# Altium schematic sheet shutdown_circuit.SchDoc: Shutdown Circuit
size A4; Engineer: T.S, R.C, S.R, C.B; Organization: Badgerloop Electrical; Address1: 133 Engineering Research Building; Address2: 1500 Engineering Drive; Address3: Madison, Wi 53706
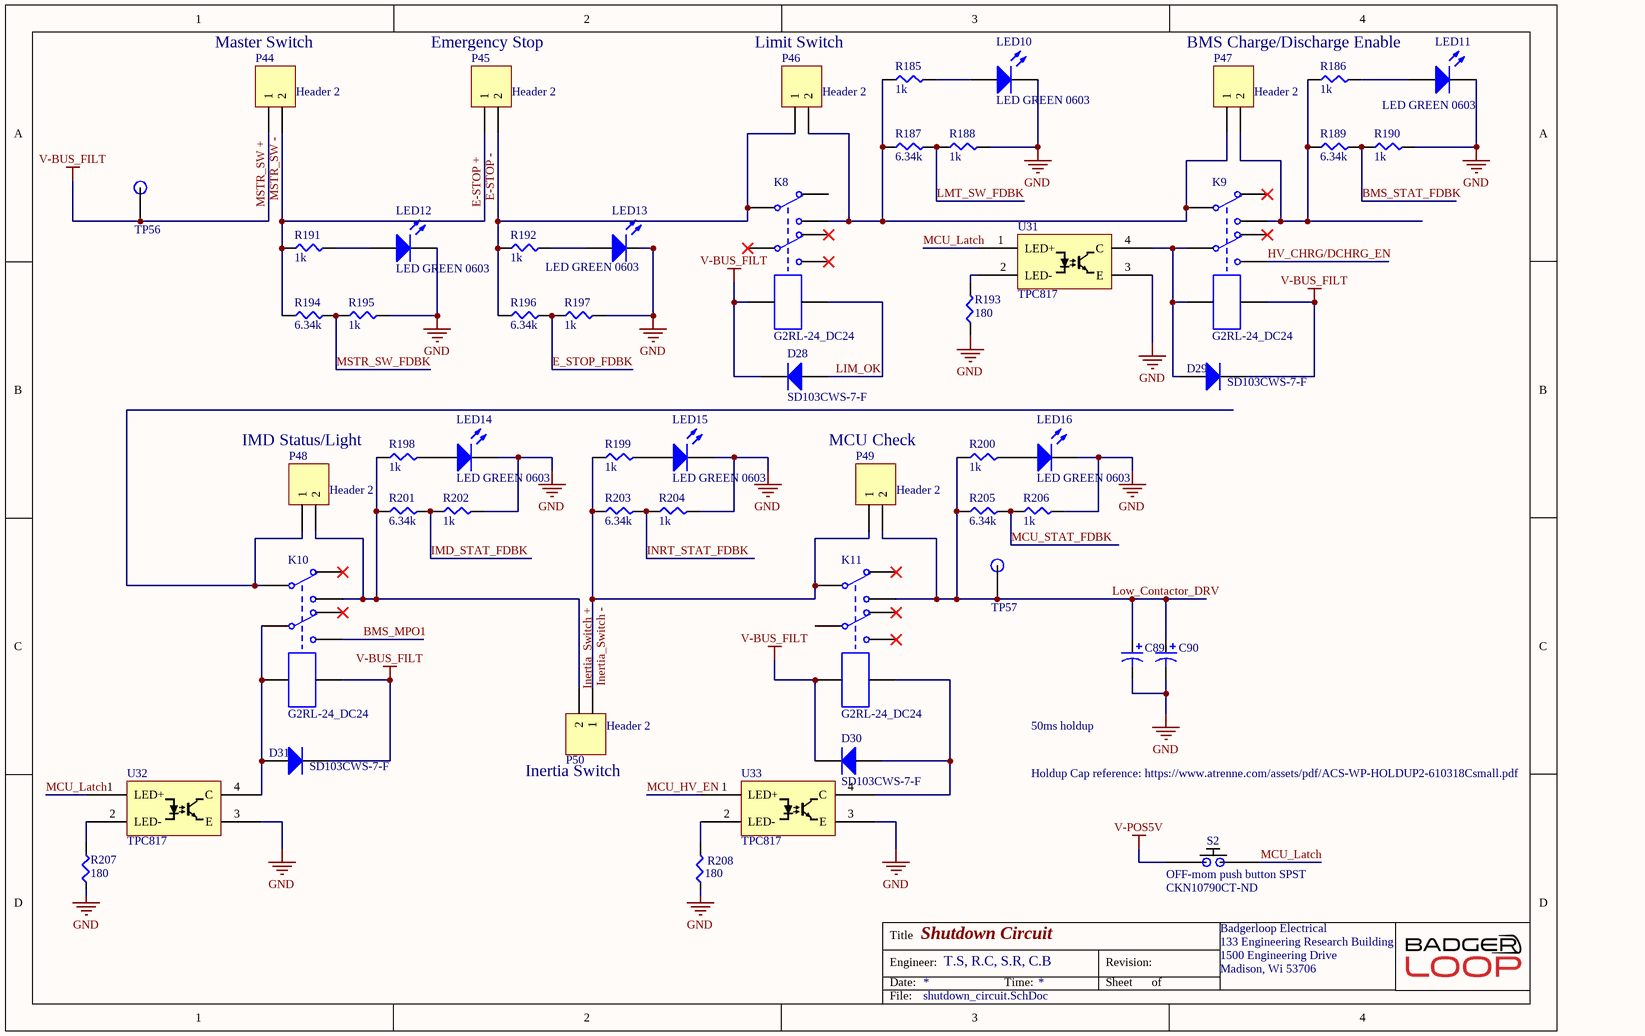
[diagram p0: shutdown_circuit.SchDoc]

## Parts
C89  PCR1J101MCL1GS  [CAPAE110103X126M]  (value not drawn)
C90  PCR1J101MCL1GS  [CAPAE110103X126M]  (value not drawn)
D28  Manufacturer P/N: SD103CWS-7-F  [SODFL250X110-2N]  (hidden comment: Diode General Purpose_2)
D29  Manufacturer P/N: SD103CWS-7-F  [SODFL250X110-2N]  (hidden comment: Diode General Purpose_2)
D30  Manufacturer P/N: SD103CWS-7-F  [SODFL250X110-2N]  (hidden comment: Diode General Purpose_2)
D31  Manufacturer P/N: SD103CWS-7-F  [SODFL250X110-2N]  (hidden comment: Diode General Purpose_2)
K8  G2RL-24_DC24  [G2RL]
K9  G2RL-24_DC24  [G2RL]
K10  G2RL-24_DC24  [G2RL]
K11  G2RL-24_DC24  [G2RL]
LED10  LED GREEN 0603  [LED 0603 GREEN]
LED11  LED GREEN 0603  [LED 0603 GREEN]
LED12  LED GREEN 0603  [LED 0603 GREEN]
LED13  LED GREEN 0603  [LED 0603 GREEN]
LED14  LED GREEN 0603  [LED 0603 GREEN]
LED15  LED GREEN 0603  [LED 0603 GREEN]
LED16  LED GREEN 0603  [LED 0603 GREEN]
P44  Header 2  [Pin Header 1x2 TH Pitch 2.54mm]
P45  Header 2  [Pin Header 1x2 TH Pitch 2.54mm]
P46  Header 2  [Pin Header 1x2 TH Pitch 2.54mm]
P47  Header 2  [Pin Header 1x2 TH Pitch 2.54mm]
P48  Header 2  [Pin Header 1x2 TH Pitch 2.54mm]
P49  Header 2  [Pin Header 1x2 TH Pitch 2.54mm]
P50  Header 2  [Pin Header 1x2 TH Pitch 2.54mm]
R185  1k  [SMD-0805-RES]
R186  1k  [SMD-0805-RES]
R187  6.34k  [SMD-0805-RES]
R188  1k  [SMD-0805-RES]
R189  6.34k  [SMD-0805-RES]
R190  1k  [SMD-0805-RES]
R191  1k  [SMD-0805-RES]
R192  1k  [SMD-0805-RES]
R193  180  [SMD-0805-RES]
R194  6.34k  [SMD-0805-RES]
R195  1k  [SMD-0805-RES]
R196  6.34k  [SMD-0805-RES]
R197  1k  [SMD-0805-RES]
R198  1k  [SMD-0805-RES]
R199  1k  [SMD-0805-RES]
R200  1k  [SMD-0805-RES]
R201  6.34k  [SMD-0805-RES]
R202  1k  [SMD-0805-RES]
R203  6.34k  [SMD-0805-RES]
R204  1k  [SMD-0805-RES]
R205  6.34k  [SMD-0805-RES]
R206  1k  [SMD-0805-RES]
R207  180  [SMD-0805-RES]
R208  180  [SMD-0805-RES]
S2  OFF-mom push button SPST  Supplier Part Number 1: CKN10790CT-ND  [K12SCS1.55NOLFTX]
TP56  TP  [Test Point]  (value not drawn)
TP57  TP  [Test Point]  (value not drawn)
U31  TPC817  [SOT200P1005X328-5N]
U32  TPC817  [SOT200P1005X328-5N]
U33  TPC817  [SOT200P1005X328-5N]

## Nets
GND: C89.2 C90.2 LED10.2(K) LED11.2(K) LED12.2(K) LED13.2(K) LED14.2(K) LED15.2(K) LED16.2(K) R188.2 R190.2 R193.1 R195.2 R197.2 R202.2 R204.2 R206.2 R207.1 R208.1 U31.3(E) U32.3(E) U33.3(E)
MSTR_SW +: D28.2(K) D29.2(K) D30.2(K) D31.2(K) K8.1 K9.8 K10.8 K11.1 P44.1 TP56.1  [also labelled V-BUS_FILT]
V-POS5V: S2.1
BMS_MPO1: K10.7
BMS_STAT_FDBK: R189.2 R190.1
E-STOP +: P44.2 P45.1 R191.1 R194.1  [also labelled MSTR_SW -]
E-STOP -: K8.3 P45.2 P46.1 R192.1 R196.1
E_STOP_FDBK: R196.2 R197.1
HV_CHRG/DCHRG_EN: K9.7
IMD_STAT_FDBK: R201.2 R202.1
Inertia_Switch +: K10.4 P48.2 P50.2 R198.1 R201.1
Inertia_Switch -: K11.3 P49.1 P50.1 R199.1 R203.1
INRT_STAT_FDBK: R203.2 R204.1
LIM_OK: D28.1(A) K8.8
LMT_SW_FDBK: R187.2 R188.1
Low_Contactor_DRV: C89.1 C90.1 K11.4 P49.2 R200.1 R205.1 TP57.1
MCU_HV_EN: U33.1(LED+)
MCU_Latch: S2.2 U31.1(LED+) U32.1(LED+)
MCU_STAT_FDBK: R205.2 R206.1
MSTR_SW_FDBK: R194.2 R195.1
NetD29_1: D29.1(A) K9.1 K9.6 U31.4(C)
NetD30_1: D30.1(A) K11.8 U33.4(C)
NetD31_1: D31.1(A) K10.1 K10.6 U32.4(C)
NetK8_4: K8.4 K9.3 P46.2 P47.1 R185.1 R187.1
NetK9_4: K9.4 P47.2 R186.1 R189.1
NetK10_3: K10.3 P48.1
NetLED10_1: LED10.1(A) R185.2
NetLED11_1: LED11.1(A) R186.2
NetLED12_1: LED12.1(A) R191.2
NetLED13_1: LED13.1(A) R192.2
NetLED14_1: LED14.1(A) R198.2
NetLED15_1: LED15.1(A) R199.2
NetLED16_1: LED16.1(A) R200.2
NetR193_2: R193.2 U31.2(LED-)
NetR207_2: R207.2 U32.2(LED-)
NetR208_2: R208.2 U33.2(LED-)

Not connected (* = marked no-connect by the designer): K8 2 5* 6* 7*; K9 2* 5*; K10 2* 5*; K11 2* 5* 6 7*

## Notes on the sheet
- Master Switch
- Emergency Stop
- Limit Switch
- BMS Charge/Discharge Enable
- (near R198) IMD Status/Light
- MCU Check
- (near P50) Inertia Switch
- 50ms holdup
- Holdup Cap reference: https://www.atrenne.com/assets/pdf/ACS-WP-HOLDUP2-610318Csmall.pdf
- Title
- Engineer:
- Date:
- Time:
- Revision:
- Sheet
- of
- File:

## Library data of the parts
C89 C90 = PCR1J101MCL1GS: CAP ALUM POLY 100UF 20% 63V SMD; Manufacturer: Nichicon; ESR (Equivalent Series Resistance): 24mR; Ripple Current: 3A; Leakage Current: 3uA; Life (Hours): 4000Hour; Dissipation Factor: 0.08%; Supplier 1: Digi-Key; Manufacturer Part Number: PCR1J101MCL1GS; Stock 1: 11476; Pricing 1: 1=3.63000, 10=2.92800, 100=2.28380 (USD); RoHS: Yes; Mount: Surface Mount,PCB; Case/Package: Radial; Weight: 0.045856oz; Min Operating Temperature: -55°C; Max Operating Temperature: 125°C; Capacitance: 100uF; Tolerance: 20%; Voltage Rating (DC): 63V; Package Quantity: 1; Packaging: Tape and Reel; Voltage Rating: 63V; Termination: SMD/SMT; Voltage: 63V; Diameter: 10mm; Length: 12.7mm; Height: 12.7mm; Height - Seated (Max): 0.504inch; Depth: 10.3mm; Lead Pitch: 4.6mm; Lead Free: Lead Free; ComponentLink1URL: https://datasheet.ciiva.com/29551/e-ch-ta-29551389.pdf?src-supplier=Digi-Key; ComponentLink1Description: https://datasheet.ciiva.com/29551/e-ch-ta-29551389.pdf?src-supplier=Digi-Key; ComponentLink2URL: https://datasheet.ciiva.com/29551/e-ch-ta-29551390.pdf?src-supplier=Digi-Key; ComponentLink2Description: https://datasheet.ciiva.com/29551/e-ch-ta-29551390.pdf?src-supplier=Digi-Key; ComponentLink3URL: https://datasheet.ciiva.com/29551/e-ch-ta-29551391.pdf?src-supplier=Digi-Key; ComponentLink3Description: https://datasheet.ciiva.com/29551/e-ch-ta-29551391.pdf?src-supplier=Digi-Key; Supplier Part Number 1: 493-13783-1-ND
D28-D31 = Diode General Purpose_2: DIODE GEN PURP 20V 350MA SOD323; Manufacturer: Diodes Incorporated; Digikey P/N: SD103CWS-FDIDKR-ND; Package / Case: SOD323; Do Not Populate: *; ComponentLink1Description: Digikey; ComponentLink1URL: https://www.digikey.com/product-detail/en/diodes-incorporated/SD103CWS-7-F/SD103CWS-FDIDKR-ND/1836772; ComponentLink2Description: Datasheet; ComponentLink2URL: https://www.diodes.com/assets/Datasheets/ds30101.pdf; ComponentLink3Description: Dimensions; ComponentLink3URL: https://www.diodes.com/assets/Package-Files/SOD323.pdf
K8-K11 = G2RL-24_DC24: RELAY GEN PURPOSE DPDT 8A 24V; Manufacturer: Omron; Manufacturer Part Number: G2RL-24-DC24; Voltage Rating (AC): 440V; Voltage Rating (DC): 300V; Power Consumption: 400mW; Coil Resistance: 1.44kR; Coil Current: 16.7mA; Operate Time: 15ms; Coil Type: Non-Latching; Relay Type: General Purpose; Release Time: 5ms; Supplier 1: Digi-Key; Stock 1: 13387; Pricing 1: 1=4.32, 10=4.053, 25=3.6028, 50=3.4226, 100=3.2425, 250=2.88224, 500=2.7021 (USD); Mount: Through Hole; Case/Package: DIP; Number of Pins: 8; Weight: 12g; Contact Material: Silver,Cadmium; Min Operating Temperature: -40°C; Max Operating Temperature: 85°C; Max Current Rating: 8A; Packaging: Bulk; Max Voltage Rating (AC): 440V; Max Voltage Rating (DC): 300V; Package Quantity: 20; Throw Configuration: DPDT; Termination: PC Pin; Contact Current Rating: 8A; Coil Voltage (DC): 24V; Coil Power: 400mW; Power Rating: 400mW; Length: 29mm; Height: 15.7mm; Width: 12.7mm; Depth: 12.7mm; Radiation Hardening: No; Lead Free: Lead Free; ComponentLink1URL: http://www.alliedelec.com/images/products/datasheets/bm/OMRON_ELECTRONICS_LLC/70175264.pdf?src-supplier=Allied+Electronics; ComponentLink1Description: http://www.alliedelec.com/images/products/datasheets/bm/OMRON_ELECTRONICS_LLC/70175264.pdf?src-supplier=Allied+Electronics; ComponentLink2URL: http://www.mouser.com/ds/2/307/en-g2rl-472571.pdf?src-supplier=Mouser; ComponentLink2Description: http://www.mouser.com/ds/2/307/en-g2rl-472571.pdf?src-supplier=Mouser
LED10-LED16 = LED GREEN 0603: Manufacturer: Lite-On Inc.; Manufacturer P/N: LTST-C190KGKT; Digikey P/N: 160-1435-1-ND; Package / Case: 0603; Color: GREEN
P44-P50 = Header 2: Header, 2-Pin; LatestRevisionDate: 17-Jul-2002; LatestRevisionNote: Re-released for DXP Platform.; Publisher: Altium Limited
R185 R186 R188 R190-R192 R195 R197-R200 R202 R204 R206 = ERJ-P06F1001V: RES SMD 1K OHM 1% 1/2W 0805; Manufacturer: Panasonic Electronic Components; Factory Stock: 0; Unit Price (USD): 0.02534; @ qty: 1500; Minimum Quantity: 1; Power (Watts): 0.5W, 1/2W; Temperature Coefficient: ±100ppm/°C; Part Number: ERJ-P06F1001V; Datasheets: https://industrial.panasonic.com/cdbs/www-data/pdf/RDA0000/AOA0000C243.pdf; Image: //media.digikey.com/Renders/Panasonic%20Renders/ERJ-0805%20Pkg.jpg; Digi-Key Part Number: P16058CT-ND; Quantity Available: 161264; Packaging: Cut Tape (CT); Series: ERJ; Part Status: Active; Value: 1k; Tolerance: ±1%; Composition: Thick Film; Features: Automotive AEC-Q200, Pulse Withstanding; Operating Temperature: -55°C ~ 155°C; Package / Case: 0805 (2012 Metric); Supplier Device Package: 0805; Size / Dimension: 0.079" L x 0.049" W (2.00mm x 1.25mm); Height - Seated (Max): 0.028" (0.70mm); Number of Terminations: 2; Failure Rate: -
R187 R189 R194 R196 R201 R203 R205 = ERJ-6ENF6341V: RES SMD 6.34K OHM 1% 1/8W 0805; Manufacturer: Panasonic Electronic Components; Factory Stock: 0; Unit Price (USD): 0.00729; @ qty: 1500; Minimum Quantity: 1; Power (Watts): 0.125W, 1/8W; Temperature Coefficient: ±100ppm/°C; Part Number: ERJ-6ENF6341V; Datasheets: http://industrial.panasonic.com/www-cgi/jvcr13pz.cgi?E+PZ+3+AOA0002+ERJ6ENF6341V+7+WW; Image: //media.digikey.com/Renders/Panasonic%20Renders/ERJ-0805%20Pkg.jpg; Digi-Key Part Number: P6.34KCCT-ND; Quantity Available: 19605; Packaging: Cut Tape (CT); Series: ERJ; Part Status: Active; Value: 6.34k; Tolerance: ±1%; Composition: Thick Film; Features: Automotive AEC-Q200; Operating Temperature: -55°C ~ 155°C; Package / Case: 0805 (2012 Metric); Supplier Device Package: 0805; Size / Dimension: 0.079" L x 0.049" W (2.00mm x 1.25mm); Height - Seated (Max): 0.028" (0.70mm); Number of Terminations: 2; Failure Rate: -
R193 R207 R208 = ERJ-6ENF1800V: RES SMD 180 OHM 1% 1/8W 0805; Manufacturer: Panasonic Electronic Components; Factory Stock: 0; Unit Price (USD): 0.00729; @ qty: 1500; Minimum Quantity: 1; Power (Watts): 0.125W, 1/8W; Temperature Coefficient: ±100ppm/°C; Part Number: ERJ-6ENF1800V; Datasheets: http://industrial.panasonic.com/www-cgi/jvcr13pz.cgi?E+PZ+3+AOA0002+ERJ6ENF1800V+7+WW; Image: //media.digikey.com/Renders/Panasonic%20Renders/ERJ-0805%20Pkg.jpg; Digi-Key Part Number: P180CCT-ND; Quantity Available: 33231; Packaging: Cut Tape (CT); Series: ERJ; Part Status: Active; Value: 180; Tolerance: ±1%; Composition: Thick Film; Features: Automotive AEC-Q200; Operating Temperature: -55°C ~ 155°C; Package / Case: 0805 (2012 Metric); Supplier Device Package: 0805; Size / Dimension: 0.079" L x 0.049" W (2.00mm x 1.25mm); Height - Seated (Max): 0.028" (0.70mm); Number of Terminations: 2; Failure Rate: -
S2 = K12SCS1.55NOLFTX: OFF-mom push button SPST K12SCS1.55NOLFTX; Manufacturer: ITT C&K; Mechanical Life: 200000Cycles; Current Rating: 100mA; Voltage Rating (DC): 30V; Actuator Type: Round, Button; Ratings: IP40; Supplier 1: Digi-Key; Manufacturer Part Number: K12SCS1.55NOLFTX; Stock 1: 4036; Pricing 1: 1=2.33, 10=2.175, 25=2.0716, 50=1.968, 100=1.9162, 250=1.86436 (USD); Mount: Surface Mount; Min Operating Temperature: -40°C; Max Operating Temperature: 85°C; Throw Configuration: SPST; Packaging: Cut Tape; Switch Function: Off-Mom; Termination: SMD/SMT; Electrical Life: 200000Cycles; ComponentLink1URL: https://www.ckswitches.com/media/1338/k12s.pdf?src-supplier=Digi-Key; ComponentLink1Description: https://www.ckswitches.com/media/1338/k12s.pdf?src-supplier=Digi-Key; ComponentLink2Description: https://www.digikey.com/product-detail/en/c-k/K12SCS1.55NOLFTX/CKN10790CT-ND/7056072; ComponentLink2URL: https://www.digikey.com/product-detail/en/c-k/K12SCS1.55NOLFTX/CKN10790CT-ND/7056072
TP56 TP57 = TP: SMD TEST POINT
U31-U33 = TPC817: OPTOISO 5KV TRANS 4SOP; Manufacturer: Taiwan Semi; Manufacturer P/N: TPC817S1B RAG; Digikey Link: https://www.digikey.com/product-detail/en/taiwan-semiconductor-corporation/TPC817S1B-RAG/TPC817S1BRAGCT-ND/7359679; Digikey P/N: TPC817S1BRAGCT-ND